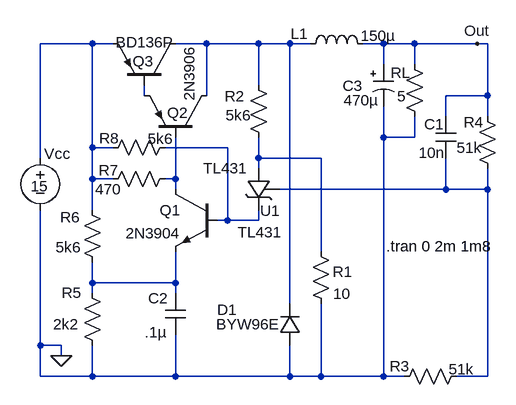
[diagram p0: schematic tl431buck.asc]
tl431buck.asc, the LTspice schematic file:
Version 4
SHEET 1 924 680
WIRE -160 32 -240 32
WIRE -128 32 -160 32
WIRE 16 32 -32 32
WIRE 96 32 16 32
WIRE 144 32 96 32
WIRE 176 32 144 32
WIRE 288 32 256 32
WIRE 336 32 288 32
WIRE 432 32 336 32
WIRE 448 32 432 32
WIRE 288 64 288 32
WIRE 336 64 336 32
WIRE 96 96 96 32
WIRE -80 112 -80 96
WIRE 16 112 16 32
WIRE 448 112 448 32
WIRE 448 112 384 112
WIRE 384 144 384 112
WIRE 448 144 448 112
WIRE 288 176 288 128
WIRE 336 176 336 144
WIRE 336 176 288 176
WIRE -160 192 -160 32
WIRE -128 192 -160 192
WIRE 48 192 -48 192
WIRE -240 208 -240 32
WIRE 96 208 96 176
WIRE 192 208 96 208
WIRE 96 224 96 208
WIRE -160 240 -160 192
WIRE -128 240 -160 240
WIRE -32 240 -32 176
WIRE -32 240 -48 240
WIRE -32 256 -32 240
WIRE 384 256 384 208
WIRE 384 256 128 256
WIRE 448 256 448 224
WIRE 448 256 384 256
WIRE -160 288 -160 240
WIRE 48 304 48 192
WIRE 48 304 32 304
WIRE 96 304 96 288
WIRE 96 304 48 304
WIRE 192 352 192 208
WIRE -160 400 -160 368
WIRE -32 400 -32 352
WIRE -32 400 -160 400
WIRE -160 416 -160 400
WIRE -32 416 -32 400
WIRE 144 432 144 32
WIRE -240 496 -240 288
WIRE -208 496 -240 496
WIRE -208 512 -208 496
WIRE -240 544 -240 496
WIRE -160 544 -160 496
WIRE -160 544 -240 544
WIRE -32 544 -32 480
WIRE -32 544 -160 544
WIRE 144 544 144 496
WIRE 144 544 -32 544
WIRE 192 544 192 432
WIRE 192 544 144 544
WIRE 288 544 288 176
WIRE 288 544 192 544
WIRE 320 544 288 544
WIRE 448 544 448 256
WIRE 448 544 400 544
FLAG -208 512 0
FLAG 432 32 Out
SYMBOL res 176 336 R0
WINDOW 0 34 47 Left 0
WINDOW 3 35 81 Left 0
SYMATTR InstName R1
SYMATTR Value 10
SYMBOL res 80 80 R0
WINDOW 0 -36 33 Left 0
WINDOW 3 -35 62 Left 0
SYMATTR InstName R2
SYMATTR Value 5k6
SYMBOL res 464 240 R180
WINDOW 0 22 87 Left 0
WINDOW 3 24 48 Left 0
SYMATTR InstName R4
SYMATTR Value 51k
SYMBOL cap 368 144 R0
WINDOW 0 -17 12 Left 0
WINDOW 3 -26 56 Left 0
SYMATTR InstName C1
SYMATTR Value 10n
SYMBOL ind 160 48 R270
WINDOW 0 16 -1 VTop 0
WINDOW 3 44 120 VBottom 0
SYMATTR InstName L1
SYMATTR Value 150µ
SYMATTR SpiceLine Ipk=1.5 Rser=0.175 Rpar=0 Cpar=0 mfg="TDK" pn="SLF12575T-151M1R5"
SYMBOL diode 128 496 M180
WINDOW 0 -96 55 Left 0
WINDOW 3 -97 32 Left 0
SYMATTR InstName D1
SYMATTR Value BYW96E
SYMBOL npn2 32 256 M0
SYMATTR InstName Q1
SYMATTR Value 2N3904
SYMBOL res -176 400 R0
WINDOW 0 -31 15 Left 0
WINDOW 3 -44 64 Left 0
SYMATTR InstName R5
SYMATTR Value 2k2
SYMBOL cap -48 416 R0
WINDOW 0 -26 8 Left 0
WINDOW 3 -31 60 Left 0
SYMATTR InstName C2
SYMATTR Value .1µ
SYMBOL res -176 272 R0
WINDOW 0 -33 27 Left 0
WINDOW 3 -40 73 Left 0
SYMATTR InstName R6
SYMATTR Value 5k6
SYMBOL res -144 256 R270
WINDOW 0 14 9 VTop 0
WINDOW 3 16 9 VBottom 0
SYMATTR InstName R7
SYMATTR Value 470
SYMBOL pnp2 16 176 M270
WINDOW 0 38 61 VLeft 0
WINDOW 3 56 27 Left 0
SYMATTR InstName Q2
SYMATTR Value 2N3906
SYMBOL pnp2 -32 96 M270
WINDOW 0 37 66 VLeft 0
WINDOW 3 66 92 VLeft 0
SYMATTR InstName Q3
SYMATTR Value BD136P
SYMBOL voltage -240 192 R0
WINDOW 3 -15 59 Left 0
WINDOW 0 6 9 Left 0
SYMATTR Value 15
SYMATTR InstName Vcc
SYMBOL polcap 272 64 R0
WINDOW 3 -45 55 Left 0
WINDOW 0 -47 33 Left 0
SYMATTR Value 470µ
SYMATTR InstName C3
SYMATTR Description Capacitor
SYMATTR Type cap
SYMATTR SpiceLine V=25 Irms=1.04 Rser=0.062 MTBF=6000 Lser=0 mfg="United Chemi-Con" pn="LXF25VB471M10X20LL" type="Al electrolytic" ppPkg=1
SYMBOL res 320 48 R0
WINDOW 0 -21 29 Left 0
WINDOW 3 -11 65 Left 0
SYMATTR InstName RL
SYMATTR Value 5
SYMBOL res -32 176 R90
WINDOW 0 17 102 VBottom 0
WINDOW 3 -13 23 VTop 0
SYMATTR InstName R8
SYMATTR Value 5k6
SYMBOL res 304 560 R270
WINDOW 0 16 9 VTop 0
WINDOW 3 43 104 VBottom 0
SYMATTR InstName R3
SYMATTR Value 51k
SYMBOL Vreg\\tl431 112 288 R180
WINDOW 0 -17 -1 Left 0
WINDOW 38 14 -34 Center 0
SYMATTR InstName U1
SYMATTR SpiceModel TL431
TEXT 456 344 Right 0 !.tran 0 2m 1m8

The netlist it stands for:
* tl431buck.asc
R1 N005 0 10
R2 N002 N005 5k6
R4 N007 Out 51k
C1 Out N007 10n
L1 N002 Out 150µ Ipk=1.5 Rser=0.175 Rpar=0 Cpar=0 mfg="TDK" pn="SLF12575T-151M1R5"
D1 0 N002 BYW96E
Q1 N006 N004 N008 0 2N3904
R5 N008 0 2k2
C2 N008 0 .1µ
R6 N001 N008 5k6
R7 N001 N006 470
Q2 N002 N006 N003 0 2N3906
Q3 N002 N003 N001 0 BD136P
Vcc N001 0 15
C3 Out 0 470µ V=25 Irms=1.04 Rser=0.062 MTBF=6000 Lser=0 mfg="United Chemi-Con" pn="LXF25VB471M10X20LL" type="Al electrolytic" ppPkg=1
RL Out 0 5
R8 N004 N001 5k6
R3 0 N007 51k
XU1 N004 N005 N007 TL431 TL431  ; pins K A R
.model D D
.lib standard.dio
.model NPN NPN
.model PNP PNP
.lib standard.bjt
.tran 0 2m 1m8
.backanno
.end